# EAGLE board csa_petio_v1.3a (EAGLE 6.4), part 1 of 2
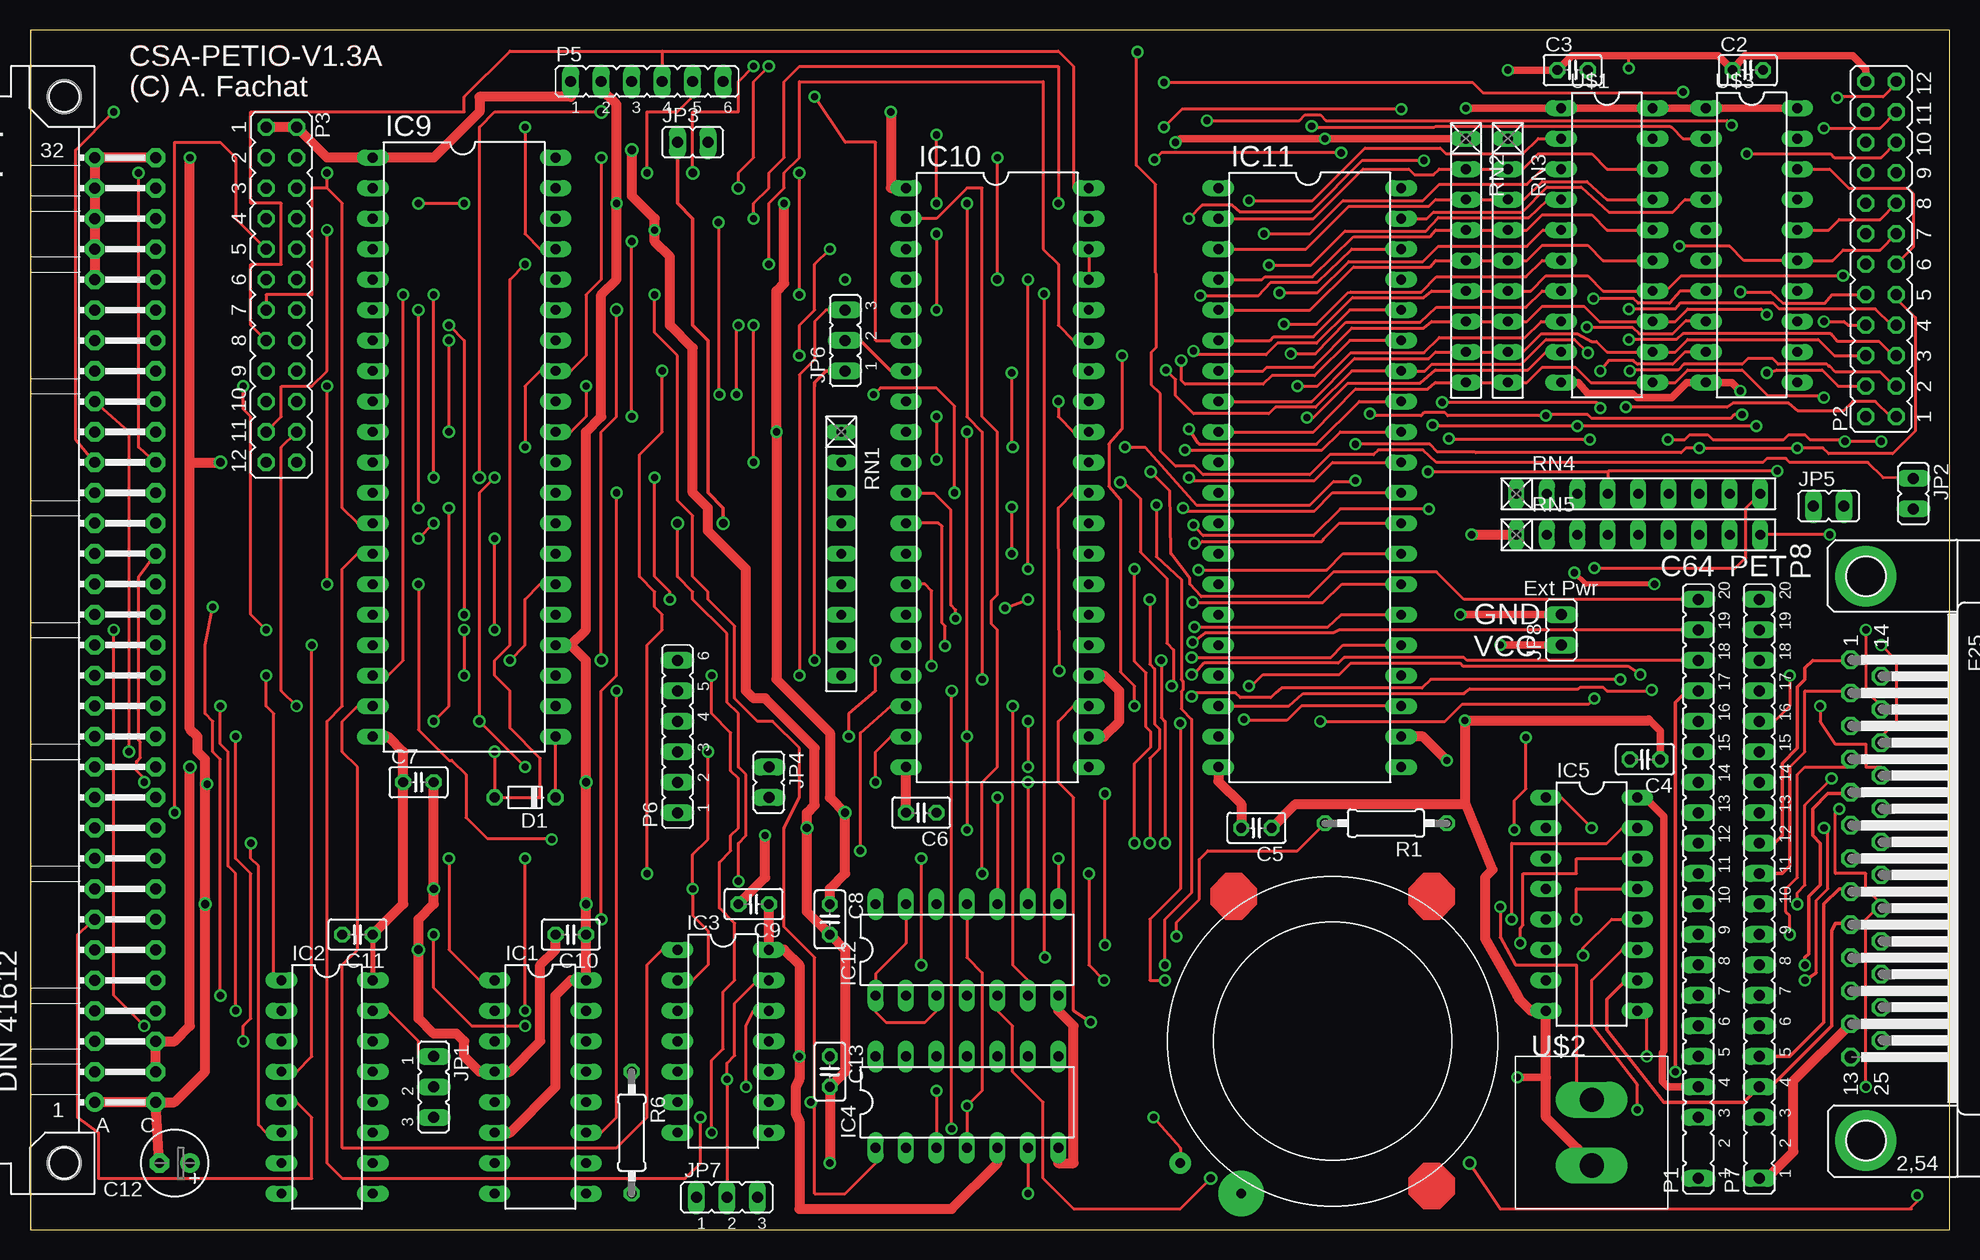
[diagram p2: board, top side]
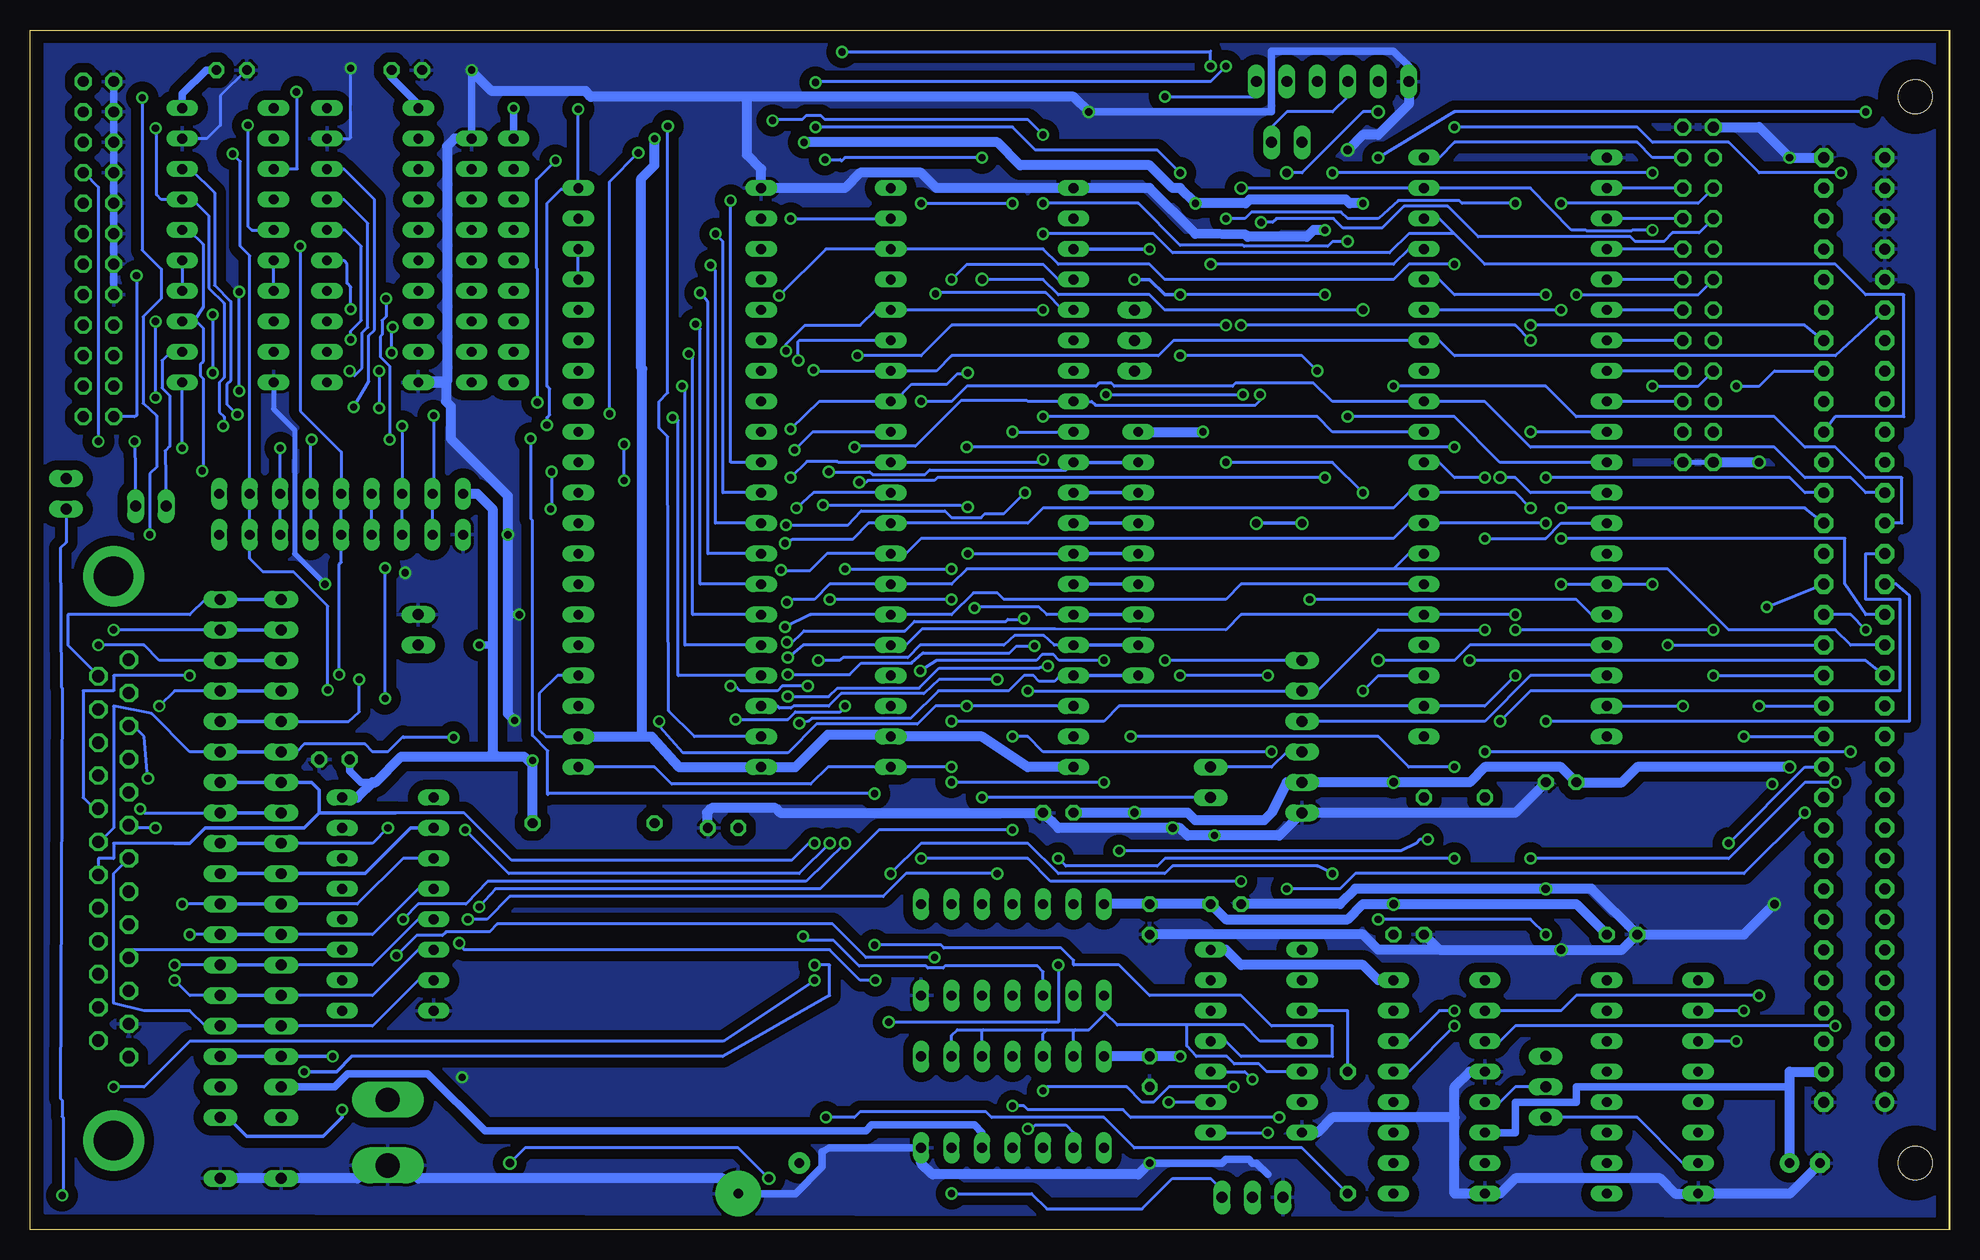
[diagram p3: board, bottom side, seen from below]

Size 160 x 100.03 mm. Coordinates in mm from the lower left corner, seen from the top.
Outline: 0,0.01 160,0.01 160,100.01 0,100.01 0,0.01
Copper layers (1*16): Top 0.035mm / dielectric 1.5mm / Bottom 0.035mm
Design rules "default *": minimum track width 10mil, minimum drill 12mil, track to track 8mil, track to pad 8mil, pad to pad 8mil, via to via 8mil, smd to smd 8mil, copper to edge 40mil, drill to drill 8mil, minimum pad ring 10mil, minimum via ring 8mil, stop-mask expansion 4mil, vias tented up to drill 0mil, thermal gap 10mil

## Footprints (pad centres in the part's own frame; a part is rotated, then mirrored left to right if it is on the bottom)
PIEZOBEEPER = drill 0.8 pad 1.778: 1 -10.16,12.7 | drill 0.8 pad 3.81: 2 -12.7,7.62
C025-025X050 = drill 0.813 octagon: 1 -1.27,0; 2 1.27,0
E2,5-6 = drill 0.813 pad 1.6: + -1.27,0 | drill 0.813 pad 1.6 octagon: - 1.27,0
D-5 = drill 0.813 octagon: A 2.54,0; C -2.54,0
DIL16 = drill 0.813 long: 1 -8.89,-3.81; 2 -6.35,-3.81; 3 -3.81,-3.81; 4 -1.27,-3.81; 5 1.27,-3.81; 6 3.81,-3.81; 7 6.35,-3.81; 8 8.89,-3.81; 9 8.89,3.81; 10 6.35,3.81; 11 3.81,3.81; 12 1.27,3.81; 13 -1.27,3.81; 14 -3.81,3.81; 15 -6.35,3.81; 16 -8.89,3.81
DIL14 = drill 0.813 long: 1 -7.62,-3.81; 2 -5.08,-3.81; 3 -2.54,-3.81; 4 0,-3.81; 5 2.54,-3.81; 6 5.08,-3.81; 7 7.62,-3.81; 8 7.62,3.81; 9 5.08,3.81; 10 2.54,3.81; 11 0,3.81; 12 -2.54,3.81; 13 -5.08,3.81; 14 -7.62,3.81
DIL40 = drill 0.813 long: 1 -16.51,-7.62; 2 -13.97,-7.62; 3 -11.43,-7.62; 4 -8.89,-7.62; 5 -6.35,-7.62; 6 -3.81,-7.62; 7 -1.27,-7.62; 8 1.27,-7.62; 9 3.81,-7.62; 10 6.35,-7.62; 11 8.89,-7.62; 12 11.43,-7.62; 13 13.97,-7.62; 14 16.51,-7.62; 15 19.05,-7.62; 16 21.59,-7.62; 17 24.13,-7.62; 18 26.67,-7.62; 19 29.21,-7.62; 20 31.75,-7.62; 21 31.75,7.62; 22 29.21,7.62; 23 26.67,7.62; 24 24.13,7.62; 25 21.59,7.62; 26 19.05,7.62; 27 16.51,7.62; 28 13.97,7.62; 29 11.43,7.62; 30 8.89,7.62; 31 6.35,7.62; 32 3.81,7.62; 33 1.27,7.62; 34 -1.27,7.62; 35 -3.81,7.62; 36 -6.35,7.62; 37 -8.89,7.62; 38 -11.43,7.62; 39 -13.97,7.62; 40 -16.51,7.62
JP2 = drill 0.914 long: 1 -2.54,0; 2 0,0; 3 2.54,0
JP1 = drill 0.914 long: 1 0,-1.27; 2 0,1.27
C64KEYB = drill 0.914 long: 1 0,0; 3 5.08,0; 4 7.62,0; 5 10.16,0; 6 12.7,0; 7 15.24,0; 8 17.78,0; 9 20.32,0; 10 22.86,0; 11 25.4,0; 12 27.94,0; 13 30.48,0; 14 33.02,0; 15 35.56,0; 16 38.1,0; 17 40.64,0; 18 43.18,0; 19 45.72,0; 20 48.26,0
FLAT24 = drill 0.914 octagon: 1 -13.97,-1.27; 2 -11.43,-1.27; 3 -8.89,-1.27; 4 -6.35,-1.27; 5 -3.81,-1.27; 6 -1.27,-1.27; 7 1.27,-1.27; 8 3.81,-1.27; 9 6.35,-1.27; 10 8.89,-1.27; 11 11.43,-1.27; 12 13.97,-1.27; A -13.97,1.27; B -11.43,1.27; C -8.89,1.27; D -6.35,1.27; E -3.81,1.27; F -1.27,1.27; H 1.27,1.27; J 3.81,1.27; K 6.35,1.27; L 8.89,1.27; M 11.43,1.27; N 13.97,1.27
CSABUS = drill 0.914 pad 1.6: A1 7.62,36.83 | drill 0.914 pad 1.6 octagon: A2 7.62,34.29; A3 7.62,31.75; A4 7.62,29.21; A5 7.62,26.67; A6 7.62,24.13; A7 7.62,21.59; A8 7.62,19.05; A9 7.62,16.51; A10 7.62,13.97; A11 7.62,11.43; A12 7.62,8.89; A13 7.62,6.35; A14 7.62,3.81; A15 7.62,1.27; A16 7.62,-1.27; A17 7.62,-3.81; A18 7.62,-6.35; A19 7.62,-8.89; A20 7.62,-11.43; A21 7.62,-13.97; A22 7.62,-16.51; A23 7.62,-19.05; A24 7.62,-21.59; A25 7.62,-24.13; A26 7.62,-26.67; A27 7.62,-29.21; A28 7.62,-31.75; A29 7.62,-34.29; A30 7.62,-36.83; A31 7.62,-39.37; A32 7.62,-41.91; C1 2.54,36.83; C2 2.54,34.29; C3 2.54,31.75; C4 2.54,29.21; C5 2.54,26.67; C6 2.54,24.13; C7 2.54,21.59; C8 2.54,19.05; C9 2.54,16.51; C10 2.54,13.97; C11 2.54,11.43; C12 2.54,8.89; C13 2.54,6.35; C14 2.54,3.81; C15 2.54,1.27; C16 2.54,-1.27; C17 2.54,-3.81; C18 2.54,-6.35; C19 2.54,-8.89; C20 2.54,-11.43; C21 2.54,-13.97; C22 2.54,-16.51; C23 2.54,-19.05; C24 2.54,-21.59; C25 2.54,-24.13; C26 2.54,-26.67; C27 2.54,-29.21; C28 2.54,-31.75; C29 2.54,-34.29; C30 2.54,-36.83; C31 2.54,-39.37; C32 2.54,-41.91 | hole 2.794: 10.16,41.91; 10.16,-46.99
JP6 = drill 0.914 long: 1 -7.62,1.27; 2 -5.08,1.27; 3 -2.54,1.27; 4 0,1.27; 5 2.54,1.27; 6 5.08,1.27
SUBD25F = drill 1.016 octagon: 1 -14.021,-10.16; 2 -11.252,-10.16; 3 -8.509,-10.16; 4 -5.74,-10.16; 5 -2.972,-10.16; 6 -0.229,-10.16; 7 2.54,-10.16; 8 5.309,-10.16; 9 8.052,-10.16; 10 10.82,-10.16; 11 13.589,-10.16; 12 16.332,-10.16; 13 19.101,-10.16; 14 -12.649,-7.62; 15 -9.881,-7.62; 16 -7.112,-7.62; 17 -4.369,-7.62; 18 -1.6,-7.62; 19 1.168,-7.62; 20 3.912,-7.62; 21 6.68,-7.62; 22 9.449,-7.62; 23 12.192,-7.62; 24 14.961,-7.62; 25 17.729,-7.62 | drill 3.302 pad 5.08: G1 -20.98,-8.89; G2 26.06,-8.89
0207/10 = drill 0.813 octagon: 1 -5.08,0; 2 5.08,0
RN-9 = drill 0.813 long: 1 -10.16,0; 2 -7.62,0; 3 -5.08,0; 4 -2.54,0; 5 0,0; 6 2.54,0; 7 5.08,0; 8 7.62,0; 9 10.16,0
DIL20 = drill 0.813 long: 1 -10.16,-3.81; 2 -7.62,-3.81; 3 -5.08,-3.81; 4 -2.54,-3.81; 5 0,-3.81; 6 2.54,-3.81; 7 5.08,-3.81; 8 7.62,-3.81; 9 10.16,-3.81; 10 12.7,-3.81; 11 12.7,3.81; 12 10.16,3.81; 13 7.62,3.81; 14 5.08,3.81; 15 2.54,3.81; 16 0,3.81; 17 -2.54,3.81; 18 -5.08,3.81; 19 -7.62,3.81; 20 -10.16,3.81
TASTER = drill 2.007 long: 1 0,4.013; 3 0,-1.473

## Placement (x,y rotation side)
BEEP1  PIEZOBEEPERPIEZO  [PIEZOBEEPER]  108.58,15.72 90 top
C2  100n  [C025-025X050]  143.19,96.69 0 top
C3  100n  [C025-025X050]  128.58,96.69 0 top
C4  100n  [C025-025X050]  134.62,39.22 180 top
C5  100n  [C025-025X050]  102.23,33.5 180 top
C6  100n  [C025-025X050]  74.29,34.77 180 top
C7  100n  [C025-025X050]  32.38,37.31 0 top
C8  100n  [C025-025X050]  66.67,25.88 270 top
C9  100n  [C025-025X050]  60.32,27.15 180 top
C10  100n  [C025-025X050]  45.08,24.61 180 top
C11  100n  [C025-025X050]  27.3,24.61 180 top
C12  47u  [E2,5-6]  12.06,5.56 180 top
C13  100n  [C025-025X050]  66.67,13.18 270 top
D1  1N4148  [D-5]  41.27,36.04 180 top
IC1  74HCT138N  [DIL16]  42.54,11.91 270 top
IC2  74HCT138N  [DIL16]  24.76,11.91 270 top
IC3  74HCT00N  [DIL14]  57.78,15.72 270 top
IC4  74LS86N  [DIL14]  78.1,10.64 0 top
IC5  74LS145N  [DIL16]  130.17,27.15 270 top
IC9  VIA  [DIL40]  36.19,72.87 270 top
IC10  PIA  [DIL40]  80.64,70.33 270 top
IC11  PIA  [DIL40]  106.67,70.33 270 top
IC12  7417N  [DIL14]  78.1,23.34 0 top
JP1  [JP2]  33.65,11.91 270 top
JP2  [JP1]  157,61.36 180 top
JP3  [JP1]  55.24,90.65 270 top
JP4  [JP1]  61.59,37.31 180 top
JP5  [JP1]  149.93,60.33 270 top
JP6  [JP2]  67.94,74.14 90 top
JP7  [JP2]  58.1,2.71 0 top
JP8  [JP1]  127.63,50.01 0 top
P1  C64KEYB  [C64KEYB]  139.06,4.29 90 top
P2  IEEE488FLATCABLE  [FLAT24]  154.3,81.76 90 top
P3  PETUSERPORT  [FLAT24]  20.95,77.95 270 top
P4  CSABUS  [CSABUS]  13.01,47.47 180 top
P5  CBMTAPE  [JP6]  52.7,94.46 0 top
P6  CBMTAPE  [JP6]  55.24,42.39 90 top
P7  PETKEYBD  [C64KEYB]  144.14,4.29 90 top
P8  PETKEYBDSUBD  [SUBD25F]  161.92,33.5 270 top
R1  4k7  [0207/10]  113.02,33.9 180 top
R6  10  [0207/10]  50.16,8.1 270 top
RN1  10k  [RN-9]  67.62,56.36 270 top
RN2  5k1  [RN-9]  119.69,80.81 270 top
RN3  2k4  [RN-9]  123.19,80.81 270 top
RN4  5k1  [RN-9]  134.06,61.36 0 top
RN5  2k4  [RN-9]  134.06,57.95 0 top
U$1  74LS641  [DIL20]  131.44,83.35 270 top
U$2  TASTER  [TASTER]  130.17,6.83 0 top
U$3  74LS641  [DIL20]  143.5,83.35 270 top